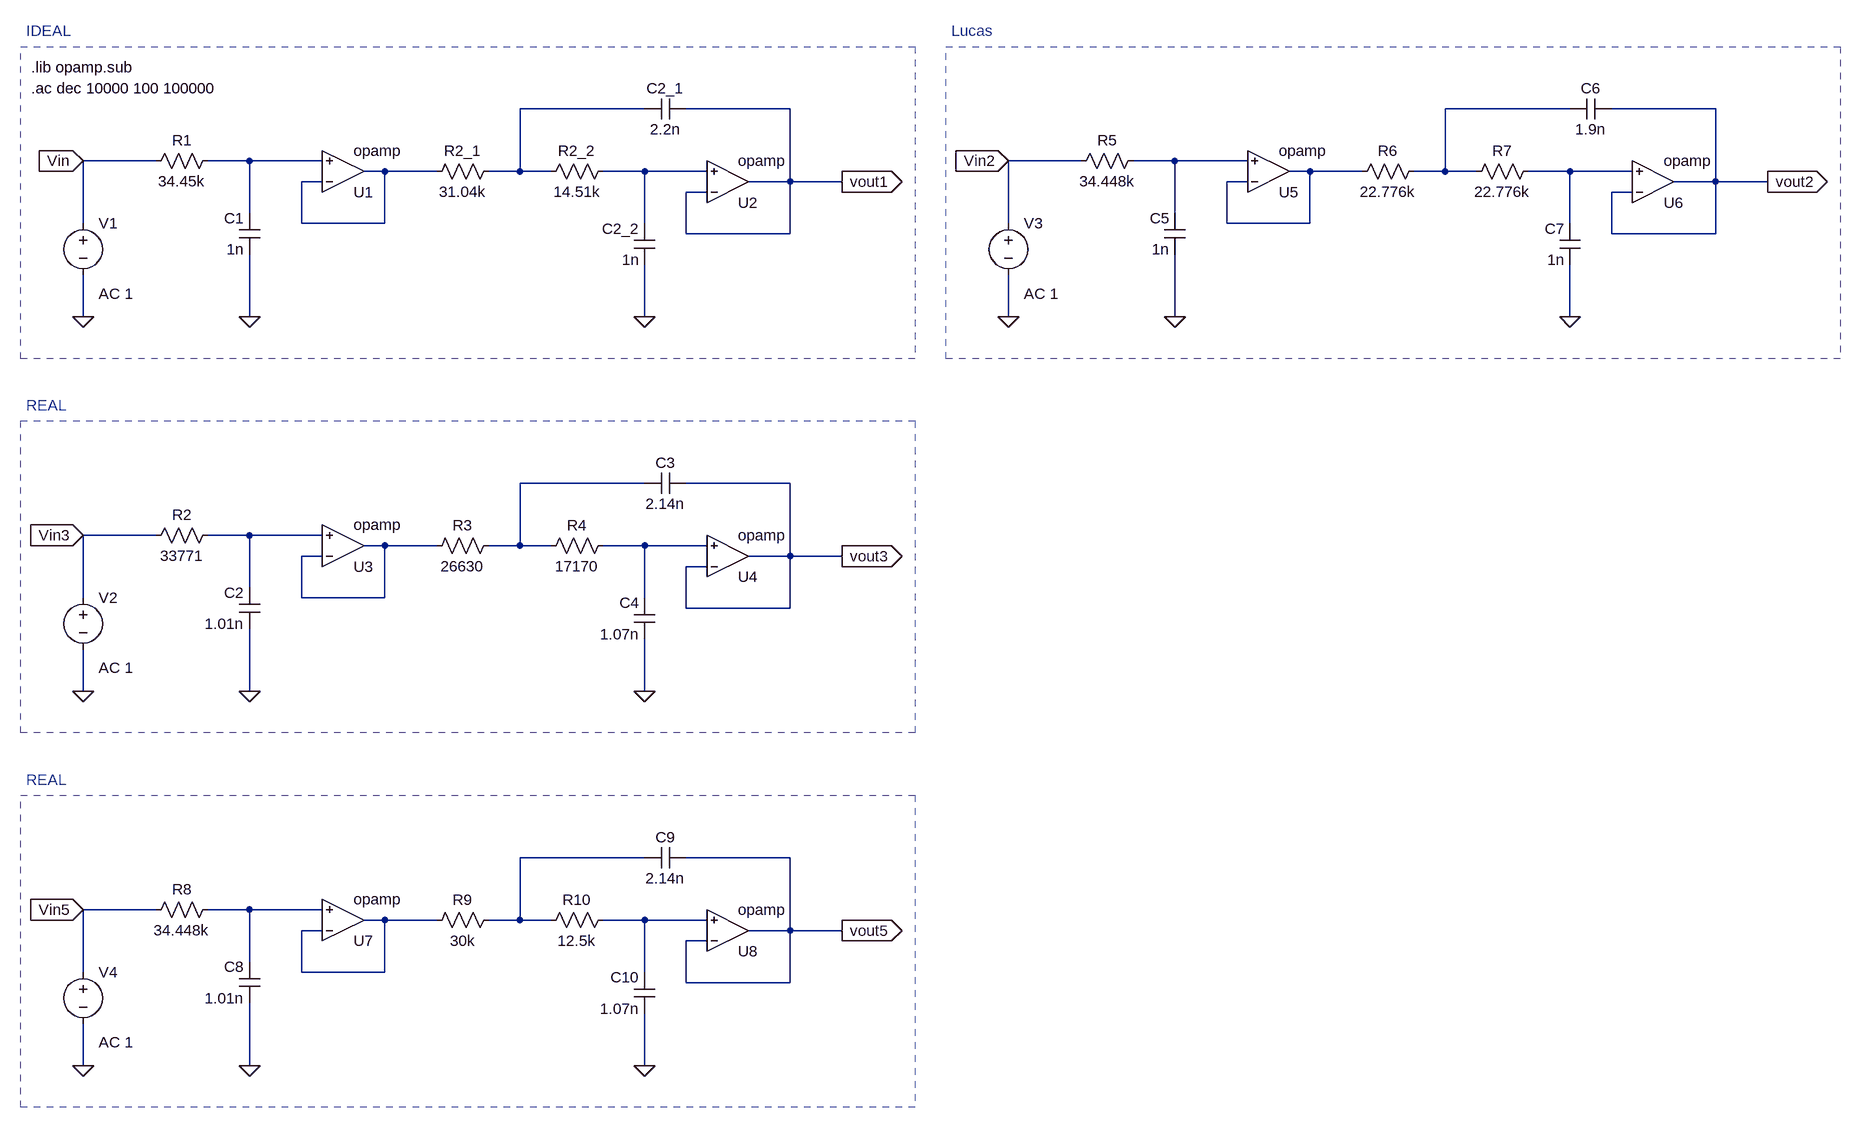
[diagram p0: schematic Bessel-Desnormalizado - copia.asc]
Bessel-Desnormalizado - copia.asc, the LTspice schematic file:
Version 4.1
SHEET 1 2604 1396
WIRE 752 -144 560 -144
WIRE 976 -144 816 -144
WIRE 2176 -144 1984 -144
WIRE 2400 -144 2240 -144
WIRE 0 -64 -112 -64
WIRE 144 -64 80 -64
WIRE 256 -64 144 -64
WIRE 1424 -64 1312 -64
WIRE 1568 -64 1504 -64
WIRE 1680 -64 1568 -64
WIRE 352 -48 320 -48
WIRE 432 -48 352 -48
WIRE 560 -48 560 -144
WIRE 560 -48 512 -48
WIRE 608 -48 560 -48
WIRE 752 -48 688 -48
WIRE 848 -48 752 -48
WIRE 1776 -48 1744 -48
WIRE 1856 -48 1776 -48
WIRE 1984 -48 1984 -144
WIRE 1984 -48 1936 -48
WIRE 2032 -48 1984 -48
WIRE 2176 -48 2112 -48
WIRE 2272 -48 2176 -48
WIRE 256 -32 224 -32
WIRE 976 -32 976 -144
WIRE 976 -32 912 -32
WIRE 1056 -32 976 -32
WIRE 1680 -32 1648 -32
WIRE 2400 -32 2400 -144
WIRE 2400 -32 2336 -32
WIRE 2480 -32 2400 -32
WIRE 848 -16 816 -16
WIRE 2272 -16 2240 -16
WIRE 144 16 144 -64
WIRE 1568 16 1568 -64
WIRE -112 32 -112 -64
WIRE 224 32 224 -32
WIRE 352 32 352 -48
WIRE 352 32 224 32
WIRE 752 32 752 -48
WIRE 1312 32 1312 -64
WIRE 1648 32 1648 -32
WIRE 1776 32 1776 -48
WIRE 1776 32 1648 32
WIRE 2176 32 2176 -48
WIRE 816 48 816 -16
WIRE 976 48 976 -32
WIRE 976 48 816 48
WIRE 2240 48 2240 -16
WIRE 2400 48 2400 -32
WIRE 2400 48 2240 48
WIRE -112 176 -112 112
WIRE 144 176 144 80
WIRE 752 176 752 96
WIRE 1312 176 1312 112
WIRE 1568 176 1568 80
WIRE 2176 176 2176 96
WIRE 752 432 560 432
WIRE 976 432 816 432
WIRE 0 512 -112 512
WIRE 144 512 80 512
WIRE 256 512 144 512
WIRE 352 528 320 528
WIRE 432 528 352 528
WIRE 560 528 560 432
WIRE 560 528 512 528
WIRE 608 528 560 528
WIRE 752 528 688 528
WIRE 848 528 752 528
WIRE 256 544 224 544
WIRE 976 544 976 432
WIRE 976 544 912 544
WIRE 1056 544 976 544
WIRE 848 560 816 560
WIRE 144 592 144 512
WIRE -112 608 -112 512
WIRE 224 608 224 544
WIRE 352 608 352 528
WIRE 352 608 224 608
WIRE 752 608 752 528
WIRE 816 624 816 560
WIRE 976 624 976 544
WIRE 976 624 816 624
WIRE -112 752 -112 688
WIRE 144 752 144 656
WIRE 752 752 752 672
WIRE 752 1008 560 1008
WIRE 976 1008 816 1008
WIRE 0 1088 -112 1088
WIRE 144 1088 80 1088
WIRE 256 1088 144 1088
WIRE 352 1104 320 1104
WIRE 432 1104 352 1104
WIRE 560 1104 560 1008
WIRE 560 1104 512 1104
WIRE 608 1104 560 1104
WIRE 752 1104 688 1104
WIRE 848 1104 752 1104
WIRE 256 1120 224 1120
WIRE 976 1120 976 1008
WIRE 976 1120 912 1120
WIRE 1056 1120 976 1120
WIRE 848 1136 816 1136
WIRE 144 1168 144 1088
WIRE -112 1184 -112 1088
WIRE 224 1184 224 1120
WIRE 352 1184 352 1104
WIRE 352 1184 224 1184
WIRE 752 1184 752 1104
WIRE 816 1200 816 1136
WIRE 976 1200 976 1120
WIRE 976 1200 816 1200
WIRE -112 1328 -112 1264
WIRE 144 1328 144 1232
WIRE 752 1328 752 1248
FLAG -112 176 0
FLAG 144 176 0
FLAG 1056 -32 vout1
IOPIN 1056 -32 Out
FLAG 752 176 0
FLAG -112 -64 Vin
IOPIN -112 -64 In
FLAG -112 752 0
FLAG 144 752 0
FLAG 1056 544 vout3
IOPIN 1056 544 Out
FLAG 752 752 0
FLAG -112 512 Vin3
IOPIN -112 512 In
FLAG 1312 176 0
FLAG 1568 176 0
FLAG 2480 -32 vout2
IOPIN 2480 -32 Out
FLAG 2176 176 0
FLAG 1312 -64 Vin2
IOPIN 1312 -64 In
FLAG -112 1328 0
FLAG 144 1328 0
FLAG 1056 1120 vout5
IOPIN 1056 1120 Out
FLAG 752 1328 0
FLAG -112 1088 Vin5
IOPIN -112 1088 In
SYMBOL voltage -112 16 R0
WINDOW 123 24 124 Left 2
WINDOW 39 0 0 Left 0
SYMATTR Value2 AC 1
SYMATTR InstName V1
SYMATTR Value ""
SYMBOL cap 160 80 R180
WINDOW 0 24 56 Left 2
WINDOW 3 24 8 Left 2
SYMATTR InstName C1
SYMATTR Value 1n
SYMBOL res 96 -80 R90
WINDOW 0 0 56 VBottom 2
WINDOW 3 32 56 VTop 2
SYMATTR InstName R1
SYMATTR Value 34.45k
SYMBOL OpAmps\\opamp 288 16 M180
SYMATTR InstName U1
SYMBOL res 528 -64 R90
WINDOW 0 0 56 VBottom 2
WINDOW 3 32 56 VTop 2
SYMATTR InstName R2_1
SYMATTR Value 31.04k
SYMBOL res 704 -64 R90
WINDOW 0 0 56 VBottom 2
WINDOW 3 32 56 VTop 2
SYMATTR InstName R2_2
SYMATTR Value 14.51k
SYMBOL cap 816 -160 R90
WINDOW 0 0 32 VBottom 2
WINDOW 3 32 32 VTop 2
SYMATTR InstName C2_1
SYMATTR Value 2.2n
SYMBOL cap 768 96 R180
WINDOW 0 24 56 Left 2
WINDOW 3 24 8 Left 2
SYMATTR InstName C2_2
SYMATTR Value 1n
SYMBOL OpAmps\\opamp 880 32 M180
SYMATTR InstName U2
SYMBOL voltage -112 592 R0
WINDOW 123 24 124 Left 2
WINDOW 39 0 0 Left 0
SYMATTR Value2 AC 1
SYMATTR InstName V2
SYMATTR Value ""
SYMBOL cap 160 656 R180
WINDOW 0 24 56 Left 2
WINDOW 3 24 8 Left 2
SYMATTR InstName C2
SYMATTR Value 1.01n
SYMBOL res 96 496 R90
WINDOW 0 0 56 VBottom 2
WINDOW 3 32 56 VTop 2
SYMATTR InstName R2
SYMATTR Value 33771
SYMBOL OpAmps\\opamp 288 592 M180
SYMATTR InstName U3
SYMBOL res 528 512 R90
WINDOW 0 0 56 VBottom 2
WINDOW 3 32 56 VTop 2
SYMATTR InstName R3
SYMATTR Value 26630
SYMBOL res 704 512 R90
WINDOW 0 0 56 VBottom 2
WINDOW 3 32 56 VTop 2
SYMATTR InstName R4
SYMATTR Value 17170
SYMBOL cap 816 416 R90
WINDOW 0 0 32 VBottom 2
WINDOW 3 32 32 VTop 2
SYMATTR InstName C3
SYMATTR Value 2.14n
SYMBOL cap 768 672 R180
WINDOW 0 24 56 Left 2
WINDOW 3 24 8 Left 2
SYMATTR InstName C4
SYMATTR Value 1.07n
SYMBOL OpAmps\\opamp 880 608 M180
SYMATTR InstName U4
SYMBOL voltage 1312 16 R0
WINDOW 123 24 124 Left 2
WINDOW 39 0 0 Left 0
SYMATTR Value2 AC 1
SYMATTR InstName V3
SYMATTR Value ""
SYMBOL cap 1584 80 R180
WINDOW 0 24 56 Left 2
WINDOW 3 24 8 Left 2
SYMATTR InstName C5
SYMATTR Value 1n
SYMBOL res 1520 -80 R90
WINDOW 0 0 56 VBottom 2
WINDOW 3 32 56 VTop 2
SYMATTR InstName R5
SYMATTR Value 34.448k
SYMBOL OpAmps\\opamp 1712 16 M180
SYMATTR InstName U5
SYMBOL res 1952 -64 R90
WINDOW 0 0 56 VBottom 2
WINDOW 3 32 56 VTop 2
SYMATTR InstName R6
SYMATTR Value 22.776k
SYMBOL res 2128 -64 R90
WINDOW 0 0 56 VBottom 2
WINDOW 3 32 56 VTop 2
SYMATTR InstName R7
SYMATTR Value 22.776k
SYMBOL cap 2240 -160 R90
WINDOW 0 0 32 VBottom 2
WINDOW 3 32 32 VTop 2
SYMATTR InstName C6
SYMATTR Value 1.9n
SYMBOL cap 2192 96 R180
WINDOW 0 24 56 Left 2
WINDOW 3 24 8 Left 2
SYMATTR InstName C7
SYMATTR Value 1n
SYMBOL OpAmps\\opamp 2304 32 M180
SYMATTR InstName U6
SYMBOL voltage -112 1168 R0
WINDOW 123 24 124 Left 2
WINDOW 39 0 0 Left 0
SYMATTR Value2 AC 1
SYMATTR InstName V4
SYMATTR Value ""
SYMBOL cap 160 1232 R180
WINDOW 0 24 56 Left 2
WINDOW 3 24 8 Left 2
SYMATTR InstName C8
SYMATTR Value 1.01n
SYMBOL res 96 1072 R90
WINDOW 0 0 56 VBottom 2
WINDOW 3 32 56 VTop 2
SYMATTR InstName R8
SYMATTR Value 34.448k
SYMBOL OpAmps\\opamp 288 1168 M180
SYMATTR InstName U7
SYMBOL res 528 1088 R90
WINDOW 0 0 56 VBottom 2
WINDOW 3 32 56 VTop 2
SYMATTR InstName R9
SYMATTR Value 30k
SYMBOL res 704 1088 R90
WINDOW 0 0 56 VBottom 2
WINDOW 3 32 56 VTop 2
SYMATTR InstName R10
SYMATTR Value 12.5k
SYMBOL cap 816 992 R90
WINDOW 0 0 32 VBottom 2
WINDOW 3 32 32 VTop 2
SYMATTR InstName C9
SYMATTR Value 2.14n
SYMBOL cap 768 1248 R180
WINDOW 0 24 56 Left 2
WINDOW 3 24 8 Left 2
SYMATTR InstName C10
SYMATTR Value 1.07n
SYMBOL OpAmps\\opamp 880 1184 M180
SYMATTR InstName U8
TEXT -192 -208 Left 2 !.lib opamp.sub
TEXT -192 -176 Left 2 !.ac dec 10000 100 100000
TEXT -200 -264 Left 2 ;IDEAL
TEXT -200 312 Left 2 ;REAL
TEXT 1224 -264 Left 2 ;Lucas
TEXT -200 888 Left 2 ;REAL
RECTANGLE Normal 1168 240 -208 -240 2
RECTANGLE Normal 1168 816 -208 336 2
RECTANGLE Normal 2592 240 1216 -240 2
RECTANGLE Normal 1168 1392 -208 912 2

The netlist it stands for:
* Bessel-Desnormalizado - copia.asc
V1 Vin 0 AC 1
C1 0 N003 1n
R1 N003 Vin 34.45k
X§U1 N005 N003 N005 opamp Aol=100K GBW=10Meg  ; pins invin noninvin out
R2_1 N001 N005 31.04k
R2_2 N006 N001 14.51k
C2_1 vout1 N001 2.2n
C2_2 0 N006 1n
X§U2 vout1 N006 vout1 opamp Aol=100K GBW=10Meg  ; pins invin noninvin out
V2 Vin3 0 AC 1
C2 0 N010 1.01n
R2 N010 Vin3 33771
X§U3 N011 N010 N011 opamp Aol=100K GBW=10Meg  ; pins invin noninvin out
R3 N009 N011 26630
R4 N012 N009 17170
C3 vout3 N009 2.14n
C4 0 N012 1.07n
X§U4 vout3 N012 vout3 opamp Aol=100K GBW=10Meg  ; pins invin noninvin out
V3 Vin2 0 AC 1
C5 0 N004 1n
R5 N004 Vin2 34.448k
X§U5 N007 N004 N007 opamp Aol=100K GBW=10Meg  ; pins invin noninvin out
R6 N002 N007 22.776k
R7 N008 N002 22.776k
C6 vout2 N002 1.9n
C7 0 N008 1n
X§U6 vout2 N008 vout2 opamp Aol=100K GBW=10Meg  ; pins invin noninvin out
V4 Vin5 0 AC 1
C8 0 N014 1.01n
R8 N014 Vin5 34.448k
X§U7 N015 N014 N015 opamp Aol=100K GBW=10Meg  ; pins invin noninvin out
R9 N013 N015 30k
R10 N016 N013 12.5k
C9 vout5 N013 2.14n
C10 0 N016 1.07n
X§U8 vout5 N016 vout5 opamp Aol=100K GBW=10Meg  ; pins invin noninvin out
.lib opamp.sub
.ac dec 10000 100 100000
* IDEAL
* REAL
* Lucas
* REAL
.backanno
.end